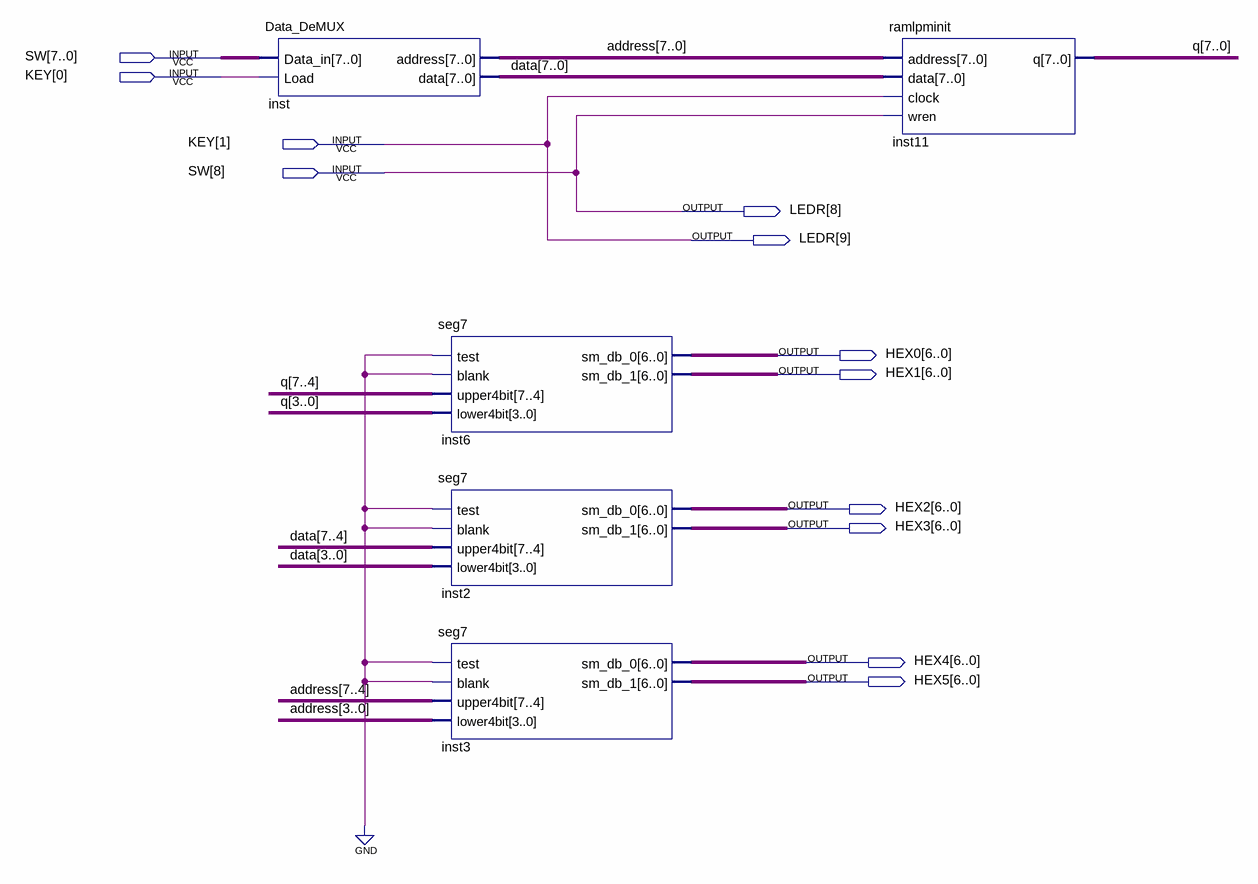
[diagram p0: schematic sheet]
// Quartus schematic lab6_beta2.bdf as structural Verilog: 5 symbols, 12 pins
module lab6_beta2 (
  input  [8:0] SW,
  input  [1:0] KEY,
  output [9:8] LEDR,
  output [6:0] HEX0,
  output [6:0] HEX1,
  output [6:0] HEX2,
  output [6:0] HEX3,
  output [6:0] HEX4,
  output [6:0] HEX5
);

  wire [7:0] address, data, q;

  Data_DeMUX inst (.Data_in(SW[7:0]), .Load(KEY[0]), .address(address), .data(data));
  seg7 inst6 (.test(1'b0), .blank(1'b0), .upper4bit(q[7:4]), .lower4bit(q[3:0]), .sm_db_0(HEX0), .sm_db_1(HEX1));
  seg7 inst2 (.test(1'b0), .blank(1'b0), .upper4bit(data[7:4]), .lower4bit(data[3:0]), .sm_db_0(HEX2), .sm_db_1(HEX3));
  seg7 inst3 (
    .test(1'b0), .blank(1'b0), .upper4bit(address[7:4]), .lower4bit(address[3:0]), .sm_db_0(HEX4),
    .sm_db_1(HEX5));
  ramlpminit inst11 (.address(address), .data(data), .clock(KEY[1]), .wren(SW[8]), .q(q));

  assign LEDR = {KEY[1], SW[8]};
endmodule
